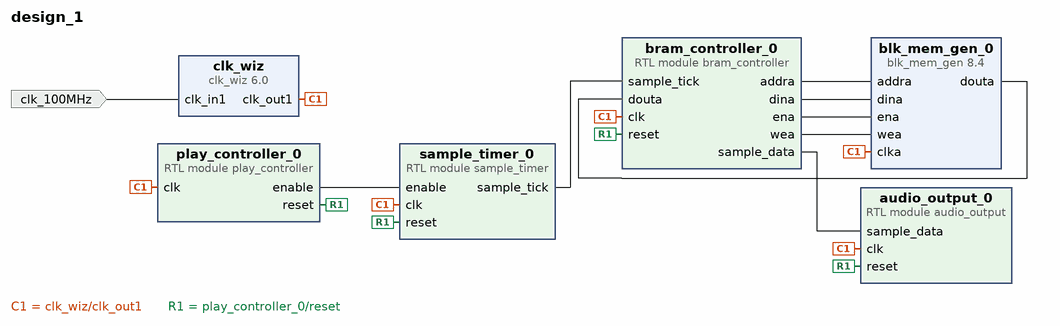
[diagram p0: block diagram of the top level]
# Vivado block design design_1, xc7a100tcsg324-1, Vivado 2023.2
create_bd_design design_1

create_bd_port -dir I -type clk clk_100MHz
set_property -dict {CONFIG.FREQ_HZ 100000000} [get_bd_ports clk_100MHz]

create_bd_cell -type ip -vlnv xilinx.com:ip:blk_mem_gen:8.4 blk_mem_gen_0
set_property -dict [list \
  CONFIG.Coe_File ../../../../../../../song.coe \
  CONFIG.Fill_Remaining_Memory_Locations false \
  CONFIG.Load_Init_File true \
  CONFIG.Operating_Mode_A READ_FIRST \
  CONFIG.use_bram_block Stand_Alone \
] [get_bd_cells blk_mem_gen_0]
create_bd_cell -type module -reference audio_output audio_output_0
create_bd_cell -type module -reference play_controller play_controller_0
create_bd_cell -type module -reference sample_timer sample_timer_0
create_bd_cell -type module -reference bram_controller bram_controller_0
create_bd_cell -type ip -vlnv xilinx.com:ip:clk_wiz:6.0 clk_wiz
set_property -dict {CONFIG.USE_RESET false} [get_bd_cells clk_wiz]

# ---- connections ----

connect_bd_net [get_bd_pins clk_wiz/clk_out1] \
  [get_bd_pins sample_timer_0/clk] [get_bd_pins blk_mem_gen_0/clka] [get_bd_pins audio_output_0/clk] \
  [get_bd_pins bram_controller_0/clk] [get_bd_pins play_controller_0/clk]
connect_bd_net [get_bd_pins blk_mem_gen_0/douta] [get_bd_pins bram_controller_0/douta]
connect_bd_net [get_bd_pins bram_controller_0/addra] [get_bd_pins blk_mem_gen_0/addra]
connect_bd_net [get_bd_pins bram_controller_0/dina] [get_bd_pins blk_mem_gen_0/dina]
connect_bd_net [get_bd_pins bram_controller_0/ena] [get_bd_pins blk_mem_gen_0/ena]
connect_bd_net [get_bd_pins bram_controller_0/sample_data] [get_bd_pins audio_output_0/sample_data]
connect_bd_net [get_bd_pins bram_controller_0/wea] [get_bd_pins blk_mem_gen_0/wea]
connect_bd_net [get_bd_ports clk_100MHz] [get_bd_pins clk_wiz/clk_in1]
connect_bd_net [get_bd_pins play_controller_0/enable] [get_bd_pins sample_timer_0/enable]
connect_bd_net [get_bd_pins play_controller_0/reset] \
  [get_bd_pins sample_timer_0/reset] [get_bd_pins audio_output_0/reset] [get_bd_pins bram_controller_0/reset]
connect_bd_net [get_bd_pins sample_timer_0/sample_tick] [get_bd_pins bram_controller_0/sample_tick]

validate_bd_design
save_bd_design
